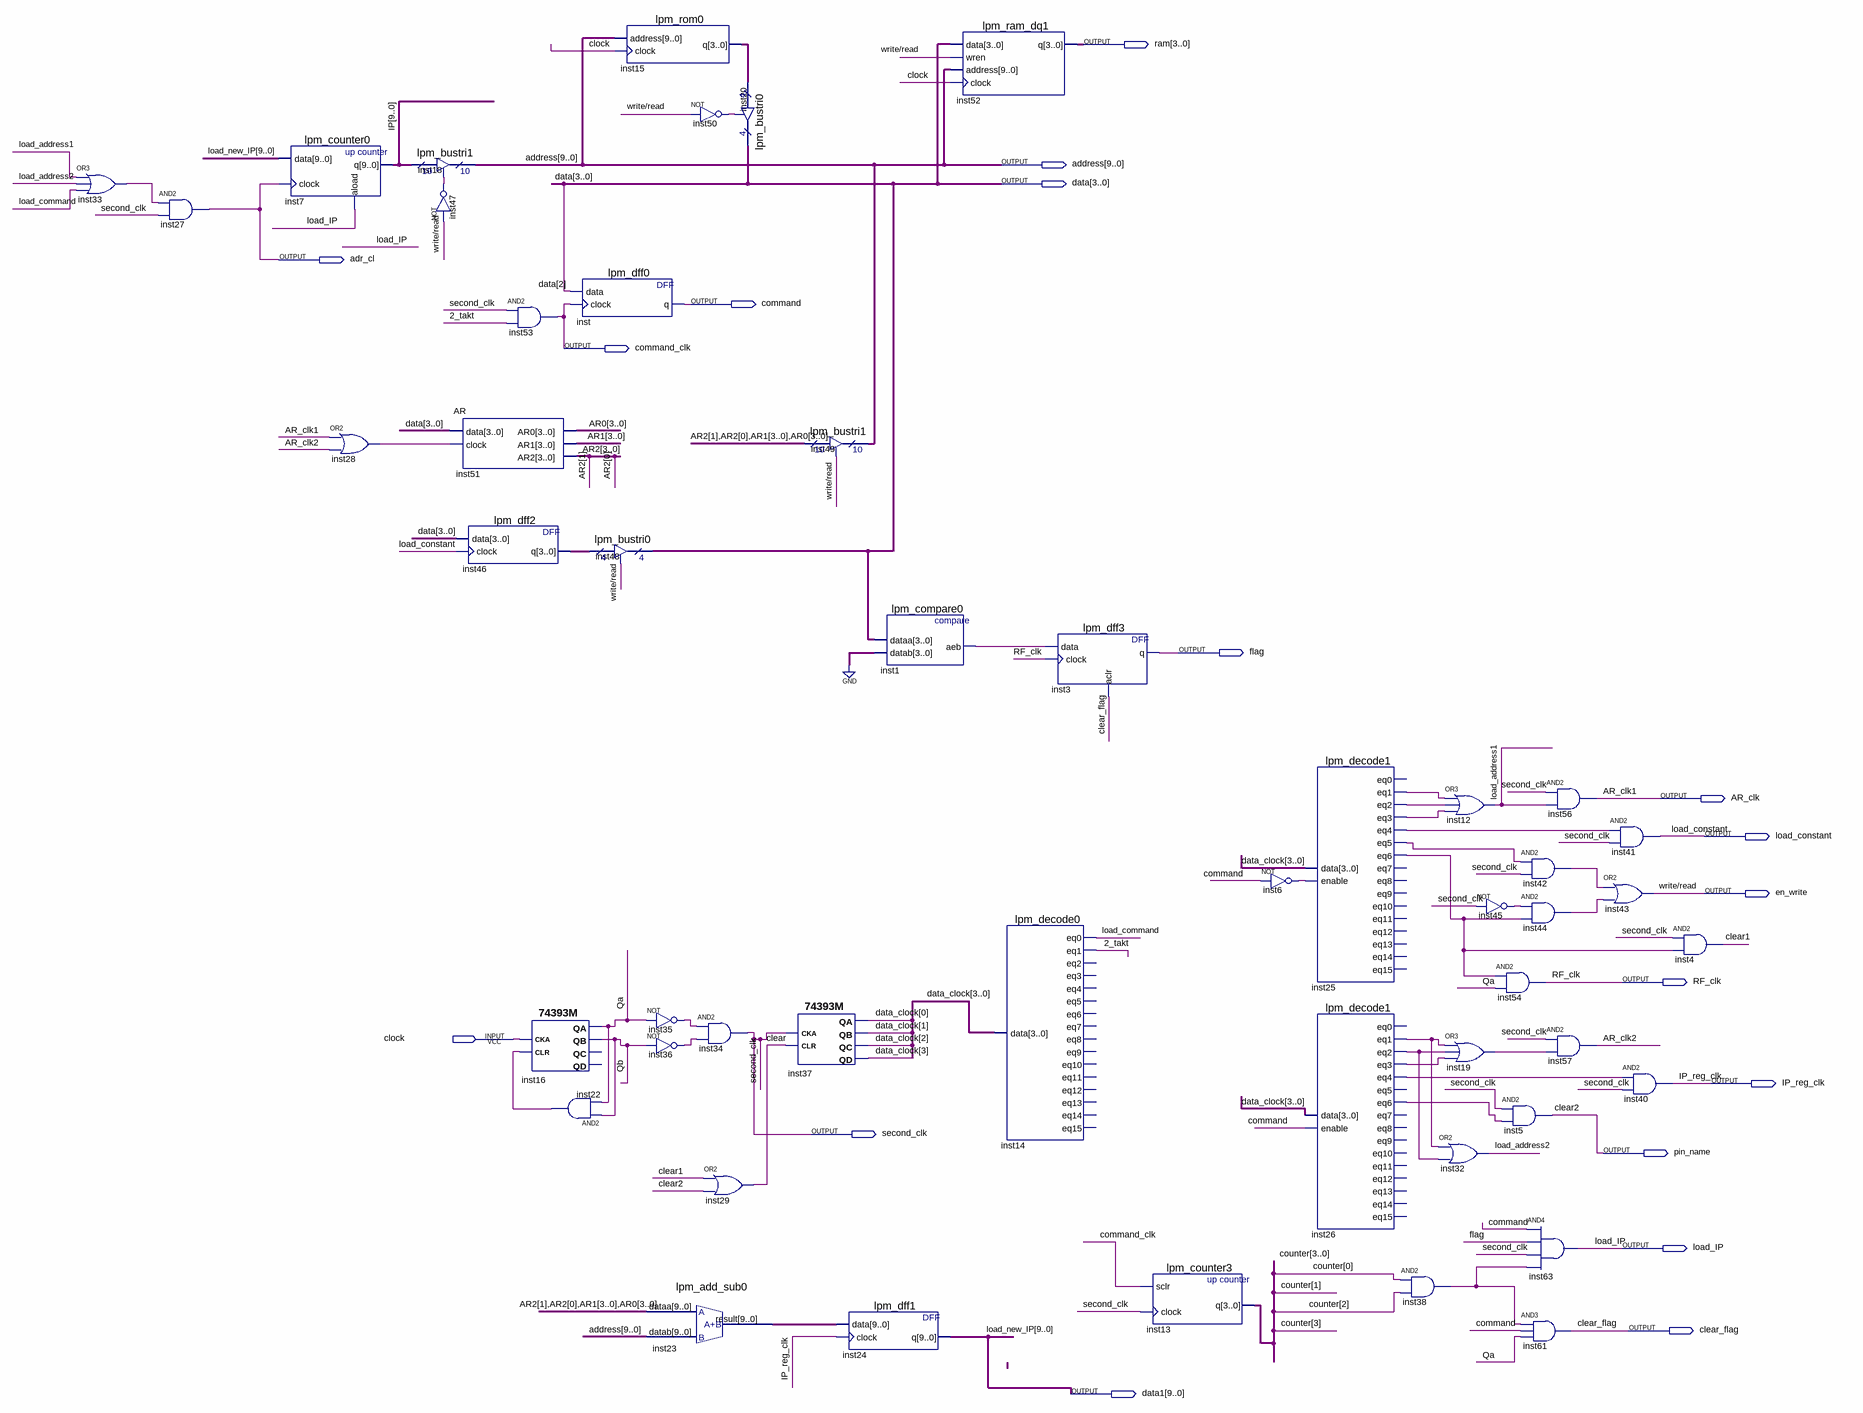
[diagram p0: schematic sheet]
// Quartus schematic Memory.bdf as structural Verilog: 49 symbols, 18 pins
module Memory (
  input  clock,
  output [3:0] ram,
  output [9:0] address,
  output [3:0] data,
  output adr_cl,
  output command,
  output command_clk,
  output flag,
  output AR_clk,
  output load_constant,
  output en_write,
  output RF_clk,
  output IP_reg_clk,
  output second_clk,
  output pin_name,
  output load_IP,
  output clear_flag,
  output [9:0] data1
);

  wire \2_takt , AR_clk2, clear, clear1, inst1_aeb, inst6_out, inst19_out, inst22_out, inst25_eq1,
       inst25_eq2, inst25_eq3, inst25_eq4, inst25_eq5, inst25_eq6, inst26_eq1, inst26_eq2, inst26_eq3,
       inst26_eq4, inst26_eq6, inst28_out, inst33_out, inst35_out, inst36_out, inst38_out, inst42_out,
       inst44_out, inst45_out, inst47_out, inst50_out, load_address1, load_address2, load_command, Qa, Qb;
  wire [3:0] AR0, AR1, AR2, counter, data_clock, inst15_q, inst46_q;
  wire [9:0] inst23_result, IP;

  or inst33 (inst33_out, load_address1, load_address2, load_command);
  and inst27 (adr_cl, inst33_out, second_clk);
  lpm_counter0 inst7 (.data(data1), .clock(adr_cl), .aload(load_IP), .q(IP));
  or inst28 (inst28_out, AR_clk, AR_clk2);
  lpm_bustri1 inst18 (.enabledt(inst47_out), .data(IP), .tridata(address));
  not inst47 (inst47_out, en_write);
  AR inst51 (.data(data), .clock(inst28_out), .AR0(AR0), .AR1(AR1), .AR2(AR2));
  lpm_dff2 inst46 (.data(data), .clock(load_constant), .q(inst46_q));
  and inst53 (command_clk, second_clk, \2_takt );
  \74393M  inst16 (.CLR(inst22_out), .CKA(clock), .QB(Qb), .QA(Qa));  // open: QC, QD
  lpm_dff0 inst (.data(data[2]), .clock(command_clk), .q(command));
  lpm_bustri0 inst48 (.enabledt(en_write), .data(inst46_q), .tridata(data));
  and inst22 (inst22_out, Qb, Qa);
  lpm_rom0 inst15 (.address(address), .clock(clock), .q(inst15_q));
  not inst35 (inst35_out, Qa);
  not inst36 (inst36_out, Qb);
  lpm_add_sub0 inst23 (.dataa({AR2[1:0], AR1, AR0}), .datab(address), .result(inst23_result));
  not inst50 (inst50_out, en_write);
  and inst34 (second_clk, inst35_out, inst36_out);
  lpm_bustri0 inst20 (.enabledt(inst50_out), .data(inst15_q), .tridata(data));
  or inst29 (clear, clear1, pin_name);
  \74393M  inst37 (
    .CLR(clear), .CKA(second_clk), .QC(data_clock[2]), .QD(data_clock[3]), .QB(data_clock[1]),
    .QA(data_clock[0]));
  lpm_bustri1 inst49 (.enabledt(en_write), .data({AR2[1:0], AR1, AR0}), .tridata(address));
  lpm_dff1 inst24 (.data(inst23_result), .clock(IP_reg_clk), .q(data1));
  lpm_compare0 inst1 (.dataa(data), .datab(4'b0000), .aeb(inst1_aeb));
  lpm_ram_dq1 inst52 (.data(data), .wren(en_write), .address(address), .clock(clock), .q(ram));
  lpm_decode0 inst14 (
    .data(data_clock), .eq0(load_command), .eq1(\2_takt ));  // open: eq2, eq3, eq4, eq5, eq6, eq7, eq8, eq9, eq10, eq11, eq12, eq13, eq14, eq15
  lpm_dff3 inst3 (.data(inst1_aeb), .clock(RF_clk), .aclr(clear_flag), .q(flag));
  lpm_counter3 inst13 (.sclr(command_clk), .clock(second_clk), .q(counter));
  lpm_decode1 inst25 (
    .data(data_clock), .enable(inst6_out), .eq1(inst25_eq1), .eq2(inst25_eq2), .eq3(inst25_eq3),
    .eq4(inst25_eq4), .eq5(inst25_eq5), .eq6(inst25_eq6));  // open: eq0, eq7, eq8, eq9, eq10, eq11, eq12, eq13, eq14, eq15
  not inst6 (inst6_out, command);
  lpm_decode1 inst26 (
    .data(data_clock), .enable(command), .eq1(inst26_eq1), .eq2(inst26_eq2), .eq3(inst26_eq3),
    .eq4(inst26_eq4), .eq6(inst26_eq6));  // open: eq0, eq5, eq7, eq8, eq9, eq10, eq11, eq12, eq13, eq14, eq15
  and inst38 (inst38_out, counter[0], counter[2]);
  or inst12 (load_address1, inst25_eq1, inst25_eq2, inst25_eq3);
  or inst19 (inst19_out, inst26_eq1, inst26_eq2, inst26_eq3);
  or inst32 (load_address2, inst26_eq1, inst26_eq2);
  not inst45 (inst45_out, second_clk);
  and inst54 (RF_clk, inst25_eq6, Qa);
  and inst5 (pin_name, second_clk, inst26_eq6);
  and inst56 (AR_clk, second_clk, load_address1);
  and inst42 (inst42_out, inst25_eq5, second_clk);
  and inst44 (inst44_out, inst45_out, inst25_eq6);
  and inst57 (AR_clk2, second_clk, inst19_out);
  and inst63 (load_IP, command, flag, second_clk, inst38_out);
  and inst61 (clear_flag, inst38_out, command, Qa);
  and inst41 (load_constant, inst25_eq4, second_clk);
  or inst43 (en_write, inst42_out, inst44_out);
  and inst40 (IP_reg_clk, inst26_eq4, second_clk);
  and inst4 (clear1, second_clk, inst25_eq6);

  // Other names for the same wires on the sheet: AR_clk1 = AR_clk; clear2 = pin_name; load_new_IP[9:0] = data1;
  //   write/read = en_write
endmodule
